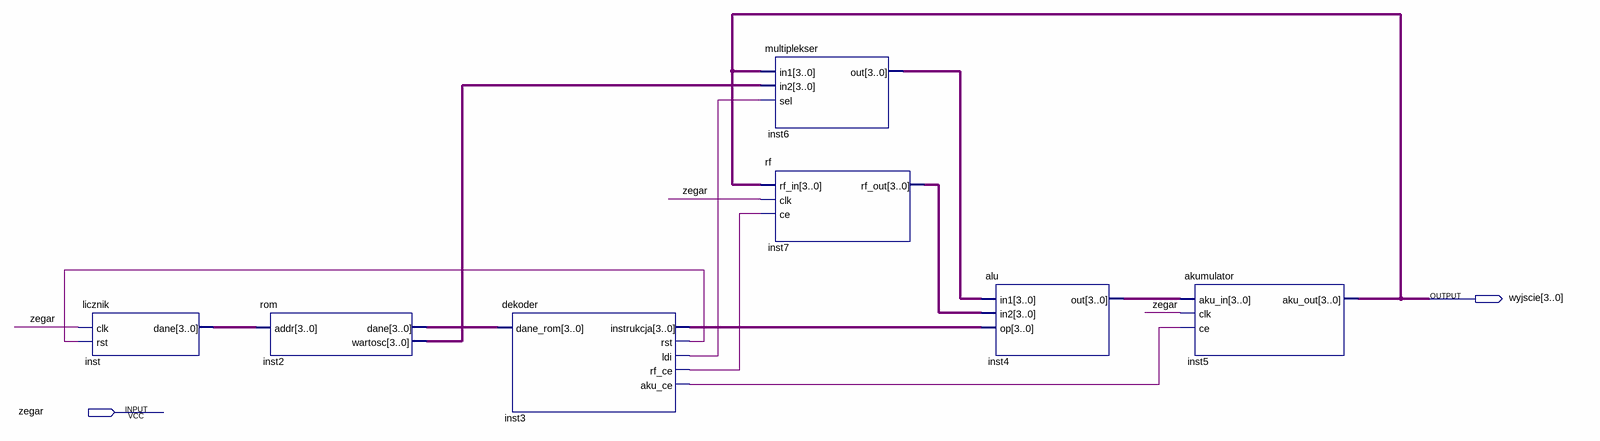
[diagram p0: schematic sheet]
// Quartus schematic procesor_1.bdf as structural Verilog: 7 symbols, 2 pins
module procesor_1 (
  input  zegar,
  output [3:0] wyjscie
);

  wire inst3_aku_ce, inst3_ldi, inst3_rf_ce, inst3_rst;
  wire [3:0] inst2_dane, inst2_wartosc, inst3_instrukcja, inst4_out, inst6_out, inst7_rf_out, inst_dane;

  licznik inst (.clk(zegar), .rst(inst3_rst), .dane(inst_dane));
  rom inst2 (.addr(inst_dane), .dane(inst2_dane), .wartosc(inst2_wartosc));
  dekoder inst3 (
    .dane_rom(inst2_dane), .instrukcja(inst3_instrukcja), .rst(inst3_rst), .ldi(inst3_ldi),
    .rf_ce(inst3_rf_ce), .aku_ce(inst3_aku_ce));
  multiplekser inst6 (.in1(wyjscie), .in2(inst2_wartosc), .sel(inst3_ldi), .out(inst6_out));
  rf inst7 (.rf_in(wyjscie), .clk(zegar), .ce(inst3_rf_ce), .rf_out(inst7_rf_out));
  alu inst4 (.in1(inst6_out), .in2(inst7_rf_out), .op(inst3_instrukcja), .out(inst4_out));
  akumulator inst5 (.aku_in(inst4_out), .clk(zegar), .ce(inst3_aku_ce), .aku_out(wyjscie));
endmodule
